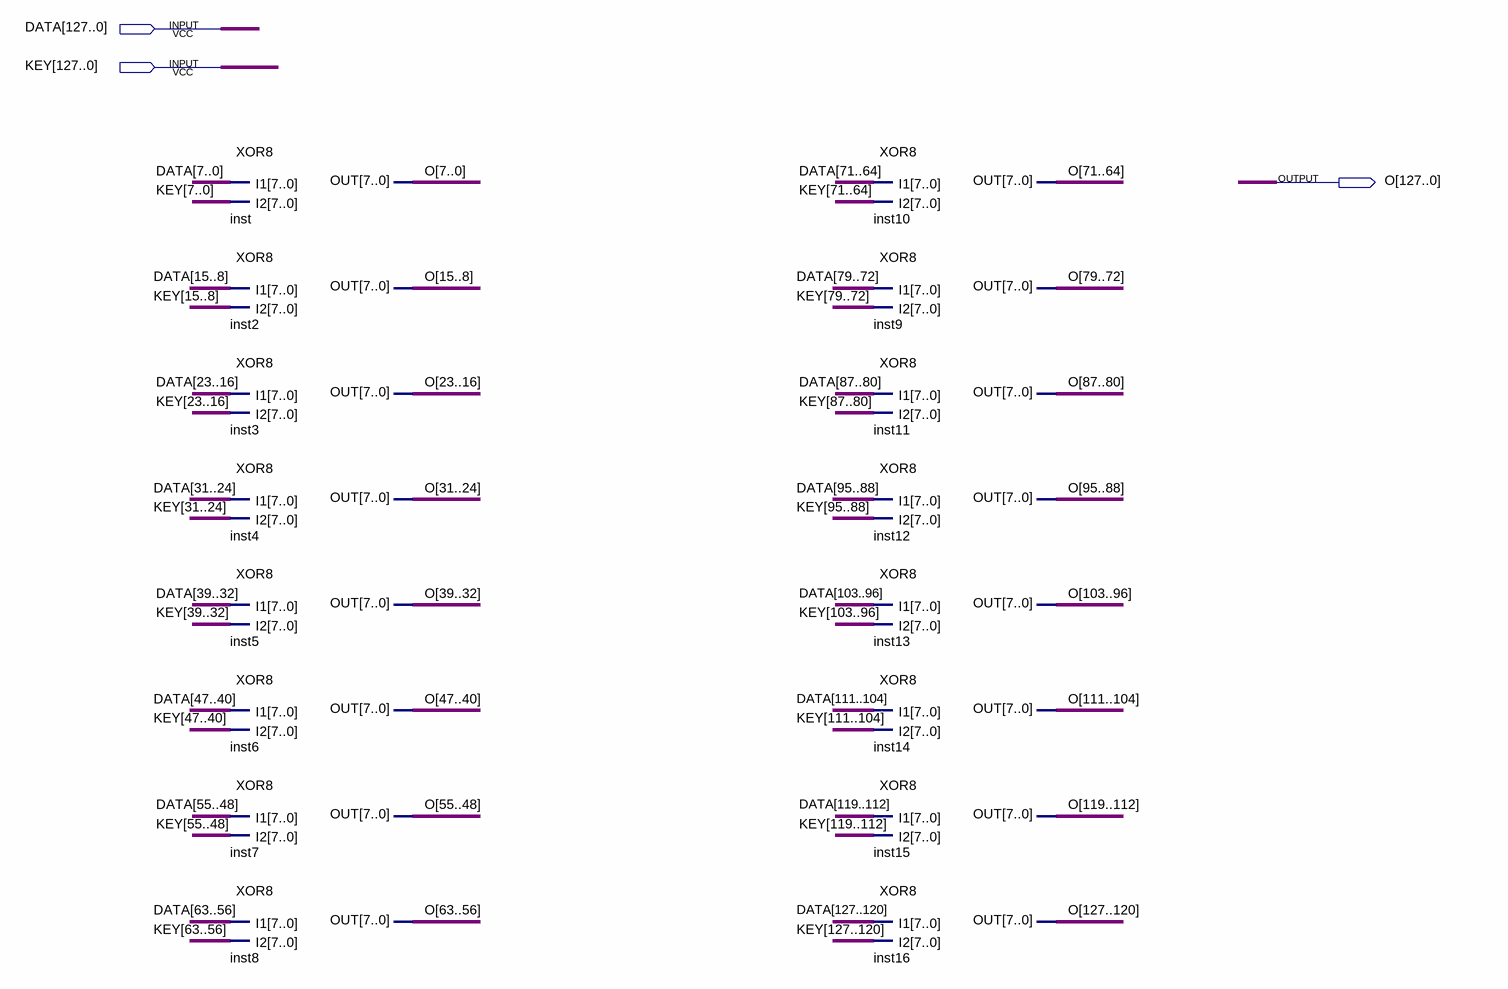
[diagram p0: schematic sheet]
// Quartus schematic ADDROUNDKEY.bdf as structural Verilog: 16 symbols, 3 pins
module ADDROUNDKEY (
  input  [127:0] DATA,
  input  [127:0] KEY,
  output [127:0] O
);

  XOR8 inst (.I1(DATA[7:0]), .I2(KEY[7:0]), .OUT(O[7:0]));
  XOR8 inst2 (.I1(DATA[15:8]), .I2(KEY[15:8]), .OUT(O[15:8]));
  XOR8 inst3 (.I1(DATA[23:16]), .I2(KEY[23:16]), .OUT(O[23:16]));
  XOR8 inst4 (.I1(DATA[31:24]), .I2(KEY[31:24]), .OUT(O[31:24]));
  XOR8 inst5 (.I1(DATA[39:32]), .I2(KEY[39:32]), .OUT(O[39:32]));
  XOR8 inst6 (.I1(DATA[47:40]), .I2(KEY[47:40]), .OUT(O[47:40]));
  XOR8 inst7 (.I1(DATA[55:48]), .I2(KEY[55:48]), .OUT(O[55:48]));
  XOR8 inst8 (.I1(DATA[63:56]), .I2(KEY[63:56]), .OUT(O[63:56]));
  XOR8 inst10 (.I1(DATA[71:64]), .I2(KEY[71:64]), .OUT(O[71:64]));
  XOR8 inst9 (.I1(DATA[79:72]), .I2(KEY[79:72]), .OUT(O[79:72]));
  XOR8 inst11 (.I1(DATA[87:80]), .I2(KEY[87:80]), .OUT(O[87:80]));
  XOR8 inst12 (.I1(DATA[95:88]), .I2(KEY[95:88]), .OUT(O[95:88]));
  XOR8 inst13 (.I1(DATA[103:96]), .I2(KEY[103:96]), .OUT(O[103:96]));
  XOR8 inst14 (.I1(DATA[111:104]), .I2(KEY[111:104]), .OUT(O[111:104]));
  XOR8 inst15 (.I1(DATA[119:112]), .I2(KEY[119:112]), .OUT(O[119:112]));
  XOR8 inst16 (.I1(DATA[127:120]), .I2(KEY[127:120]), .OUT(O[127:120]));
endmodule
